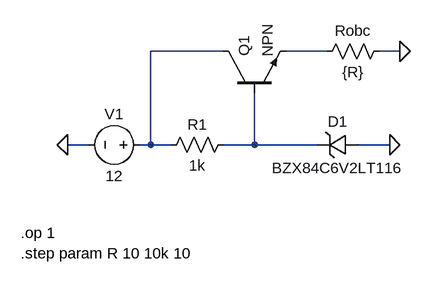
[diagram p0: schematic Tranzystor.asc]
Tranzystor.asc, the LTspice schematic file:
Version 4
SHEET 1 880 680
WIRE 240 -80 128 -80
WIRE 400 -80 336 -80
WIRE 512 -80 480 -80
WIRE 32 64 0 64
WIRE 128 64 128 -80
WIRE 128 64 112 64
WIRE 160 64 128 64
WIRE 288 64 288 -16
WIRE 288 64 240 64
WIRE 384 64 288 64
WIRE 496 64 448 64
FLAG 0 64 0
FLAG 496 64 0
FLAG 512 -80 0
SYMBOL voltage 128 64 R90
WINDOW 0 -32 56 VBottom 2
WINDOW 3 32 56 VTop 2
WINDOW 123 0 0 Left 0
WINDOW 39 0 0 Left 0
SYMATTR InstName V1
SYMATTR Value 12
SYMBOL res 256 48 R90
WINDOW 0 0 56 VBottom 2
WINDOW 3 32 56 VTop 2
SYMATTR InstName R1
SYMATTR Value 1k
SYMBOL res 496 -96 R90
WINDOW 0 0 56 VBottom 2
WINDOW 3 32 56 VTop 2
SYMATTR InstName Robc
SYMATTR Value {R}
SYMBOL zener 448 48 R90
WINDOW 0 -4 32 VBottom 2
WINDOW 3 36 32 VTop 2
SYMATTR InstName D1
SYMATTR Value BZX84C6V2LT116
SYMBOL npn 240 -16 R270
SYMATTR InstName Q1
TEXT -72 200 Left 2 !.op 1\n.step param R 10 10k 10

The netlist it stands for:
* Tranzystor.asc
V1 N001 0 12
R1 N003 N001 1k
Robc 0 N002 {R}
D1 0 N003 BZX84C6V2LT116
Q1 N001 N003 N002 0 NPN
.model D D
.lib standard.dio
.model NPN NPN
.model PNP PNP
.lib standard.bjt
.op 1
.step param R 10 10k 10
.backanno
.end